# EAGLE schematic yabr6v3 (EAGLE 9.0.1)
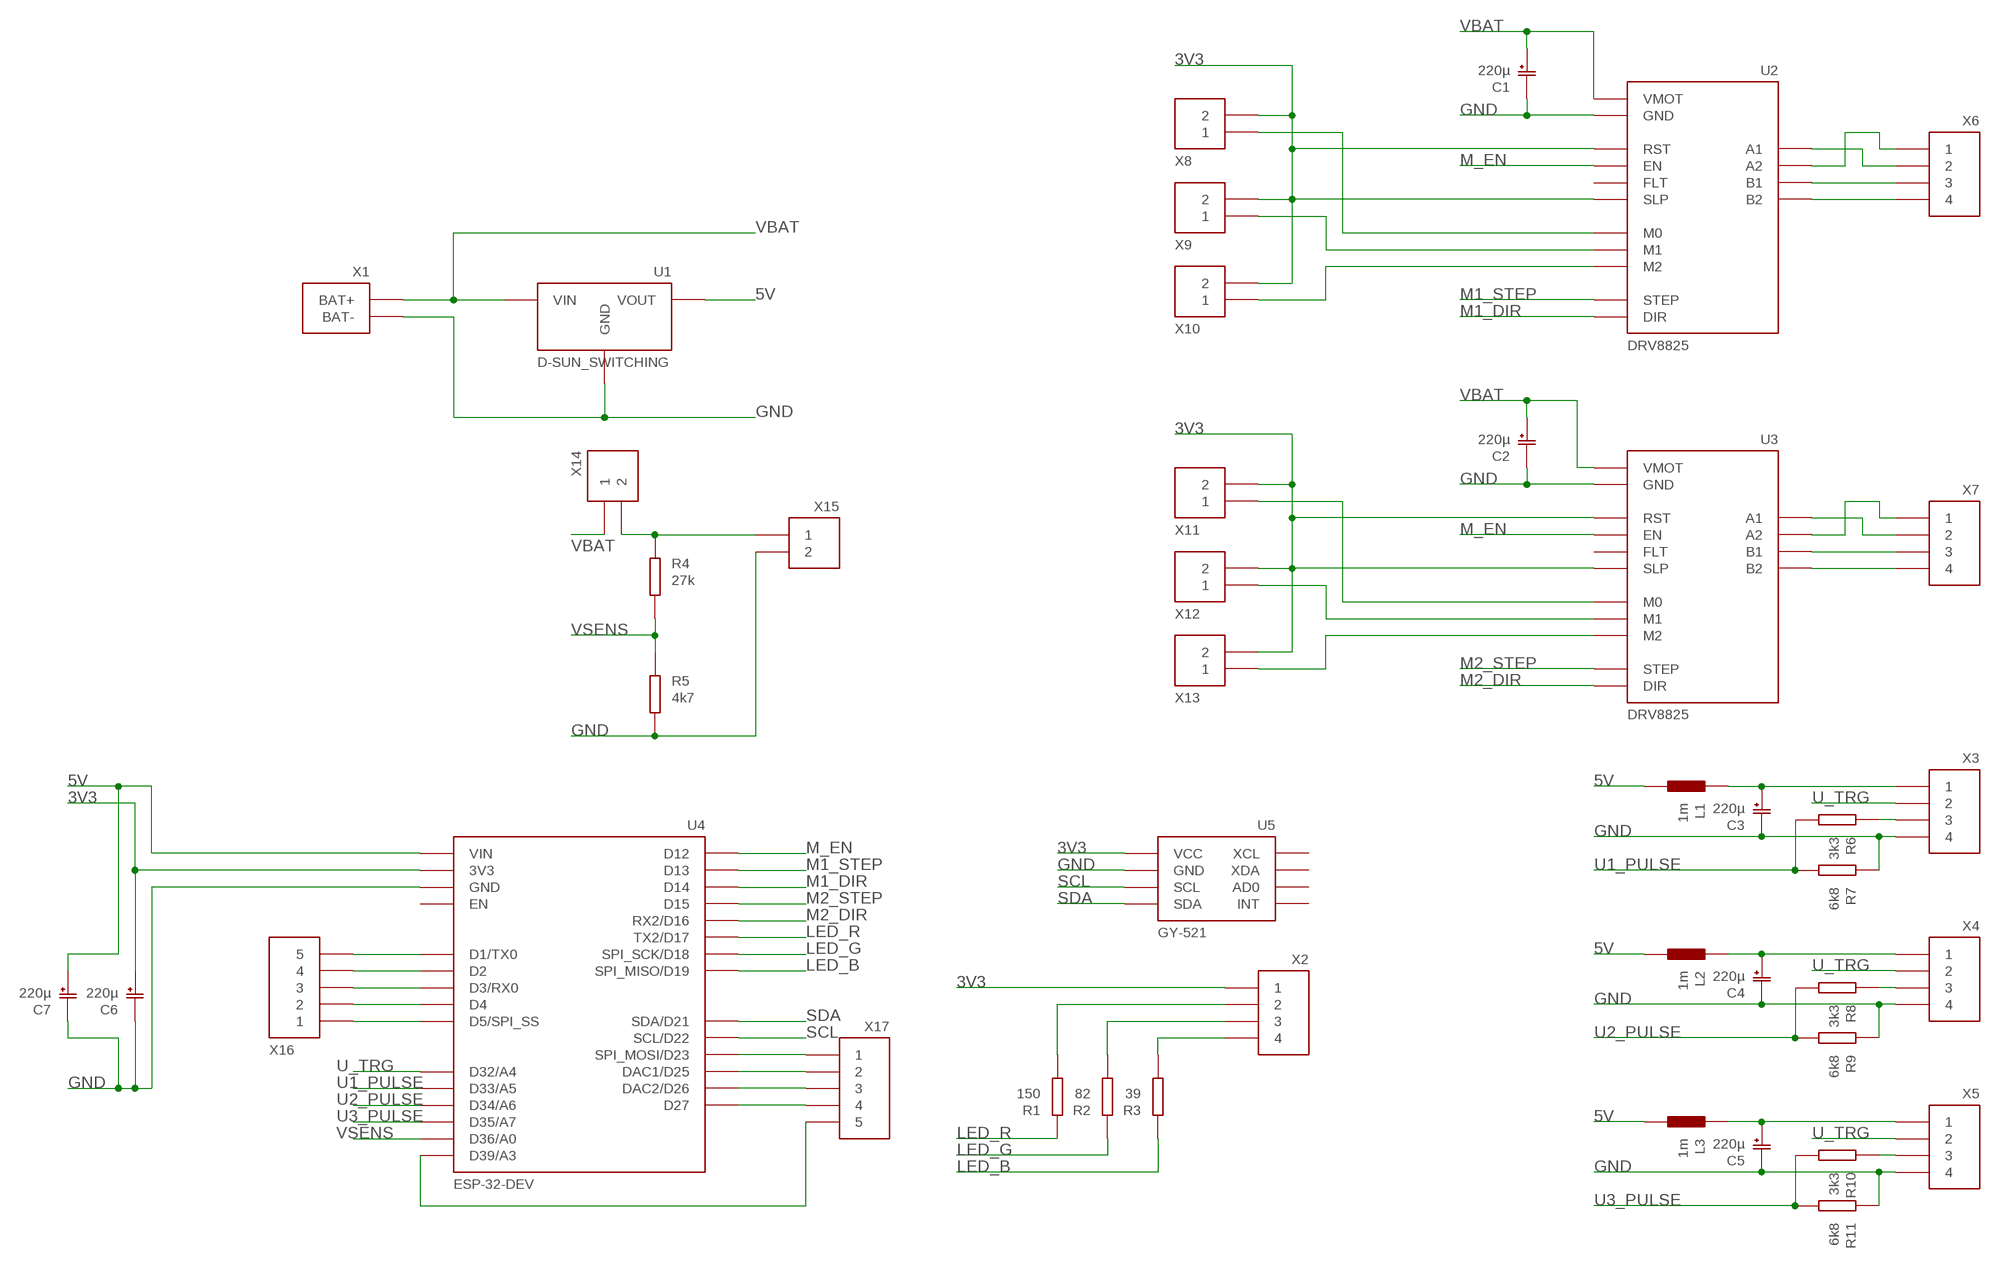
[diagram p0: schematic, sheet 1]

## Parts
C1  220µ  CPOL3,5  [CPOL_3,5]
C2  220µ  CPOL3,5  [CPOL_3,5]
C3  220µ  CPOL3,5  [CPOL_3,5]
C4  220µ  CPOL3,5  [CPOL_3,5]
C5  220µ  CPOL3,5  [CPOL_3,5]
C6  220µ  CPOL3,5  [CPOL_3,5]
C7  220µ  CPOL3,5  [CPOL_3,5]
L1  1m  L_NEO  [NEOSID_SD75]
L2  1m  L_NEO  [NEOSID_SD75]
L3  1m  L_NEO  [NEOSID_SD75]
R1  150  R12  [R_12]
R2  82  R12  [R_12]
R3  39  R12  [R_12]
R4  27k  R12  [R_12]
R5  4k7  R12  [R_12]
R6  3k3  R12  [R_12]
R7  6k8  R12  [R_12]
R8  3k3  R12  [R_12]
R9  6k8  R12  [R_12]
R10  3k3  R12  [R_12]
R11  6k8  R12  [R_12]
U1  D-SUN_SWITCHING  [D-SUN_SWITCHING]
U2  DRV8825  [DRV8825]
U3  DRV8825  [DRV8825]
U4  ESP-32-DEV  [ESP-32-DEV]
U5  GY-521  [GY-521]
X1  BAT  [BAT]
X2  X4  [X4]
X3  X4  [X4]
X4  X4  [X4]
X5  X4  [X4]
X6  X4  [X4]
X7  X4  [X4]
X8  X2  [X2]
X9  X2  [X2]
X10  X2  [X2]
X11  X2  [X2]
X12  X2  [X2]
X13  X2  [X2]
X14  X2  [X2]
X15  X2  [X2]
X16  X5  [X5]
X17  X5  [X5]

## Nets
3V3: C6.P(+) U2.P$11(SLP) U2.P$12(RST) U3.P$11(SLP) U3.P$12(RST) U4.P$15(3V3) U5.P$8(VCC) X2.P$1 X8.P$2 X9.P$2 X10.P$2 X11.P$2 X12.P$2 X13.P$2
5V: C7.P(+) L1.P L2.P L3.P U1.PO2(VOUT) U1.PO(VOUT) U4.P$16(VIN)
GND: C1.N(-) C2.N(-) C3.N(-) C4.N(-) C5.N(-) C6.N(-) C7.N(-) R5.P R7.N R9.N R11.N U1.NI2(GND) U1.NI(GND) U1.NO2(GND) U1.NO(GND) U2.P$2(GND) U2.P$8(GND) U3.P$2(GND) U3.P$8(GND) U4.P$14(GND) U4.P$17(GND) U5.P$7(GND) X1.N(BAT-) X3.P$4 X4.P$4 X5.P$4 X15.P$2
LED_B: R3.N U4.P$6(SPI_MISO/D19)
LED_G: R2.N U4.P$7(SPI_SCK/D18)
LED_R: R1.N U4.P$9(TX2/D17)
M1_DIR: U2.P$9(DIR) U4.P$20(D14)
M1_STEP: U2.P$10(STEP) U4.P$18(D13)
M2_DIR: U3.P$9(DIR) U4.P$10(RX2/D16)
M2_STEP: U3.P$10(STEP) U4.P$13(D15)
M_EN: U2.P$16(EN) U3.P$16(EN) U4.P$19(D12)
N$1: U2.P$5(A1) X6.P$2
N$2: U2.P$6(A2) X6.P$1
N$3: U2.P$4(B1) X6.P$3
N$4: U2.P$3(B2) X6.P$4
N$5: U3.P$5(A1) X7.P$2
N$6: U3.P$6(A2) X7.P$1
N$7: U3.P$4(B1) X7.P$3
N$8: U3.P$3(B2) X7.P$4
N$9: U2.P$15(M0) X8.P$1
N$10: U2.P$14(M1) X9.P$1
N$11: U2.P$13(M2) X10.P$1
N$12: U3.P$15(M0) X11.P$1
N$13: U3.P$14(M1) X12.P$1
N$14: U3.P$13(M2) X13.P$1
N$15: C3.P(+) L1.N X3.P$1
N$16: R3.P X2.P$4
N$17: R2.P X2.P$3
N$18: C4.P(+) L2.N X4.P$1
N$19: R6.N X3.P$3
N$20: R4.N X14.P$2 X15.P$1
N$21: C5.P(+) L3.N X5.P$1
N$22: R8.N X4.P$3
N$23: R1.P X2.P$2
N$24: U4.P$8(D5/SPI_SS) X16.P$1
N$25: R10.N X5.P$3
N$26: U4.P$11(D4) X16.P$2
N$27: U4.P$4(D3/RX0) X16.P$3
N$28: U4.P$12(D2) X16.P$4
N$29: U4.P$3(D1/TX0) X16.P$5
N$30: U4.P$1(SPI_MOSI/D23) X17.P$1
N$31: U4.P$23(DAC1/D25) X17.P$2
N$32: U4.P$22(DAC2/D26) X17.P$3
N$33: U4.P$21(D27) X17.P$4
N$34: U4.P$28(D39/A3) X17.P$5
SCL: U4.P$2(SCL/D22) U5.P$6(SCL)
SDA: U4.P$5(SDA/D21) U5.P$5(SDA)
U1_PULSE: R6.P R7.P U4.P$24(D33/A5)
U2_PULSE: R8.P R9.P U4.P$27(D34/A6)
U3_PULSE: R10.P R11.P U4.P$26(D35/A7)
U_TRG: U4.P$25(D32/A4) X3.P$2 X4.P$2 X5.P$2
VBAT: C1.P(+) C2.P(+) U1.PI2(VIN) U1.PI(VIN) U2.P$1(VMOT) U3.P$1(VMOT) X1.P(BAT+) X14.P$1
VSENS: R4.P R5.N U4.P$29(D36/A0)
Unconnected: U2.P$7(FLT) U3.P$7(FLT) U4.P$30(EN) U5.P$1(INT) U5.P$2(AD0) U5.P$3(XDA) U5.P$4(XCL)

## Library data of the parts
C1-C7 = draradech:CPOL
L1-L3 = draradech:L
R1-R11 = draradech:R
U1 = draradech:D-SUN_SWITCHING
U2 U3 = draradech:DRV8825
U4 = draradech:ESP-32-DEV
U5 = draradech:GY-521
X1 = draradech:BAT
X2-X7 = draradech:X4
X8-X15 = draradech:X2
X16 X17 = draradech:X5